# Altium schematic sheet pwr.SchDoc
size A4; Organization: Arribada Initiative; Address1: https://github.com/arribada; Address2: contact@arribada.org; Address3: arribada.org; Address4: UK - Portsmouth; DocumentNumber: 3; SheetNumber: 3; SheetTotal: 13
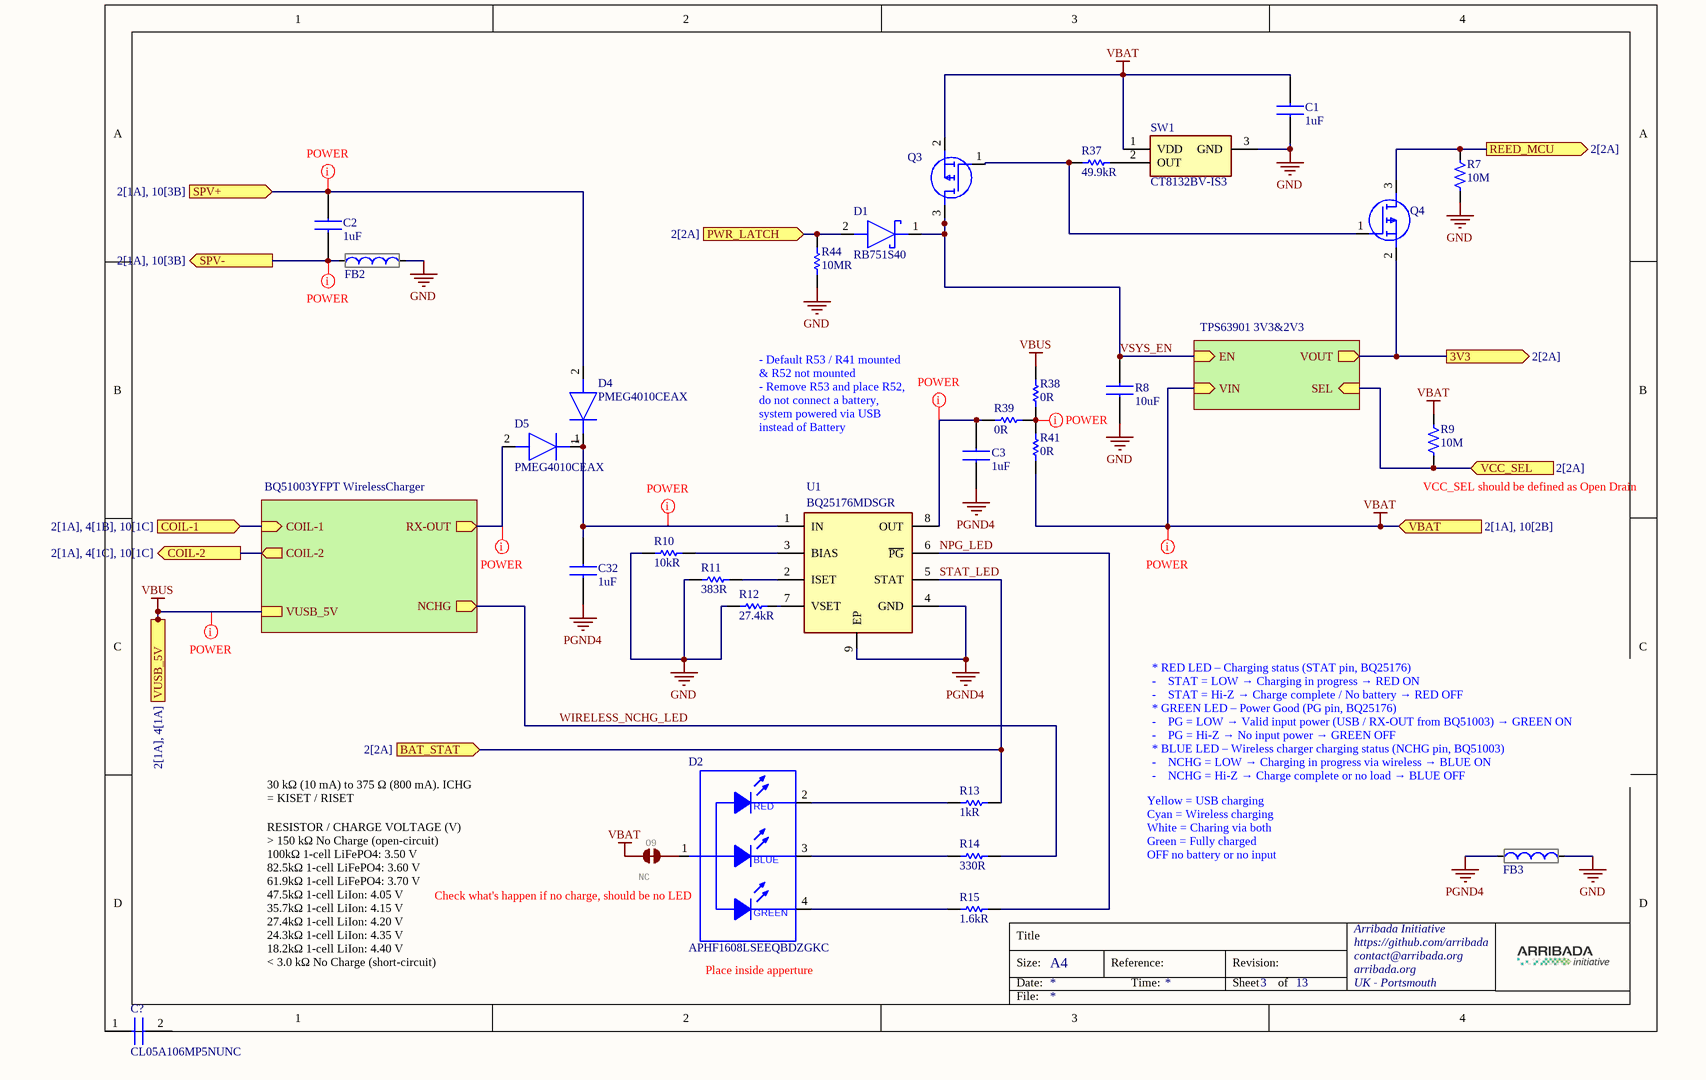
[diagram p0: pwr.SchDoc]

## Parts
C1  value 1uF  [CAPC1005X55N]  (hidden comment: GRM155R61E105KE11D)
C2  value 1uF  [GRM15x]  (hidden comment: GRM155R61H105ME05J)
C3  value 1uF  [CAPC1608X90N]  (hidden comment: GCM188R71C105KA64D)
C32  value 1uF  [GRM15x]  (hidden comment: GRM155R61H105ME05J)
C?  CL05A106MP5NUNC  [CAPC1005X55N]
D1  RB751S40  [SODFL1608X65N]
D2  APHF1608LSEEQBDZGKC  [LED RGB 0603]
D4  PMEG4010CEAX  [SOD2512X110N]
D5  PMEG4010CEAX  [SOD2512X110N]
FB2  BLM18AG102SN1D  [BLM18SP221SN1B]  (value not drawn)
FB3  BLM18AG102SN1D  [BLM18SP221SN1B]  (value not drawn)
O9  NC  [SMT-JUMPER_2_NC_TRACE_SILK]  (net tie, no BOM)
Q3  IRLML6401TRPBF  [SOT95P237X112-3N]  (value not drawn)
Q4  IRLML6401TRPBF  [SOT95P237X112-3N]  (value not drawn)
R7  value 10M  [RES0402L]  (hidden comment: 10M 0402 1%)
R8  value 10uF  [CAPC1005X55N]  (hidden comment: CL05A106MP5NUNC)
R9  value 10M  [RES0402L]  (hidden comment: 10M 0402 1%)
R10  value 10kR  [ERJS02_U02_(0402)]  (hidden comment: ERJ-U02F1002X)
R11  value 383R  [RESC0603X28N]  (hidden comment: CRCW0201383RFNED)
R12  value 27.4kR  [RESC0603X28N]  (hidden comment: CRCW020127K4FNED)
R13  value 1kR  [RESC1005X40N]  (hidden comment: RC0402JR-7D1KL)
R14  value 330R  [RESC1005X40N]  (hidden comment: RC0402JR-7D330RL)
R15  value 1.6kR  [RESC1005X40N]  (hidden comment: CRCW04021K60JNED)
R37  value 49.9kR  [RESC1005X40N]  (hidden comment: CRCW040249K9FKED)
R38  value 0R  [RESC1005X40N]  (hidden comment: CRCW04020000Z0EEHP)
R39  value 0R  [RESC1005X40N]  (hidden comment: CRCW04020000Z0EEHP)
R41  value 0R  [RESC1005X40N]  (hidden comment: CRCW04020000Z0EEHP)
R44  value 10MR  [RESC0603X26N]  (hidden comment: RC0201FR-0710ML)
SW1  CT8132BV-IS3  [SOT95P280X140-3N]
U1  BQ25176MDSGR  [SON50P200X200X80-9N]

## Sub-sheets
BQ51003YFPT WirelessCharger = BQ51003YFPT_WirelessCharger_2.5W: COIL-2 (out), COIL-1 (in), RX-OUT (out), VUSB_5V, NCHG (out)
TPS63901 3V3&2V3 = TPS63901_BuckBoost_lowIq_3V3&2V3_400mA: VIN (in), VOUT (out), EN (in), SEL (in)

## Ports
3V3 (out, see 2[2A]), BAT_STAT (in, see 2[2A]), COIL-1 (in, see 2[1A], 4[1B], 10[1C]), COIL-2 (out, see 2[1A], 4[1C], 10[1C]), PWR_LATCH (in, see 2[2A]), REED_MCU (out, see 2[2A]), SPV+ (in, see 2[1A], 10[3B]), SPV- (out, see 2[1A], 10[3B]), VBAT (in, see 2[1A], 10[2B]), VCC_SEL (in, see 2[2A]), VUSB_5V (see 2[1A], 4[1A])

## Nets
GND: C1.2 FB2.2 FB3.2 R7.1 R8.1 R10.1 R11.1 R12.1 R44.1 SW1.3(GND)
PGND4: C3.1 C32.2 FB3.1 U1.4(GND) U1.9(EP)
VBAT: C1.1 O9.1 Q3.2(S) R9.2 R41.2 SW1.1(VDD) ; port VBAT, sheet TPS63901 3V3&2V3/VIN
VBUS: R38.2 ; port VUSB_5V, sheet BQ51003YFPT WirelessCharger/VUSB_5V
3V3: Q4.2(S) ; port 3V3, sheet TPS63901 3V3&2V3/VOUT
COIL-1: port COIL-1, sheet BQ51003YFPT WirelessCharger/COIL-1
COIL-2: port COIL-2, sheet BQ51003YFPT WirelessCharger/COIL-2
NPG_LED: R15.2 U1.6(~{PG})
PWR_LATCH: D1.2(A) R44.2 ; port PWR_LATCH
REED_MCU: Q4.3(D) R7.2 ; port REED_MCU
SPV+: C2.1 D4.2(A) ; port SPV+
SPV-: C2.2 FB2.1 ; port SPV-
STAT_LED: R13.2 U1.5(STAT) ; port BAT_STAT
VCC_SEL: R9.1 ; port VCC_SEL, sheet TPS63901 3V3&2V3/SEL
VSYS_EN: D1.1(K) Q3.3(D) R8.2 ; sheet TPS63901 3V3&2V3/EN
WIRELESS_NCHG_LED: R14.1 ; sheet BQ51003YFPT WirelessCharger/NCHG
NetC3_2: C3.2 R39.1 U1.8(OUT)
NetC32_1: C32.1 D4.1(K) D5.1(K) U1.1(IN)
NetD2_1: D2.1 O9.2
NetD2_2: D2.2 R13.1
NetD2_3: D2.3 R14.2
NetD2_4: D2.4 R15.1
NetD5_2: D5.2(A) ; sheet BQ51003YFPT WirelessCharger/RX-OUT
NetQ3_1: Q3.1(G) Q4.1(G) R37.1
NetR10_2: R10.2 U1.3(BIAS)
NetR11_2: R11.2 U1.2(ISET)
NetR12_2: R12.2 U1.7(VSET)
NetR37_2: R37.2 SW1.2(OUT)
NetR38_1: R38.1 R39.2 R41.1

Not connected (* = marked no-connect by the designer): C? 1 2

## Layout directives
net class POWER; rule Width Constraint [Pref Width = 0.5mm    Min Width = 0.4mm    Max Width = 1mm]: NetC3_2, NetC32_1, NetD5_2, NetR38_1, SPV+, SPV-, VBAT, VBUS

## Notes on the sheet
- - Default R53 / R41 mounted & R52 not mounted
  - Remove R53 and place R52, do not connect a battery, system powered via USB instead of Battery
- (near R9) VCC_SEL should be defined as Open Drain
- * RED LED – Charging status (STAT pin, BQ25176)
  -    STAT = LOW → Charging in progress → RED ON
  -    STAT = Hi-Z → Charge complete / No battery → RED OFF
  * GREEN LED – Power Good (PG pin, BQ25176)
  -    PG = LOW → Valid input power (USB / RX-OUT from BQ51003) → GREEN ON
  -    PG = Hi-Z → No input power → GREEN OFF
  * BLUE LED – Wireless charger charging status (NCHG pin, BQ51003)
  -    NCHG = LOW → Charging in progress via wireless → BLUE ON
  -    NCHG = Hi-Z → Charge complete or no load → BLUE OFF
- 30 kΩ (10 mA) to 375 Ω (800 mA). ICHG = KISET / RISET
- (near D2) Check what's happen if no charge, should be no LED
- Yellow = USB charging
  Cyan = Wireless charging
  White = Charing via both
  Green = Fully charged
  OFF no battery or no input
- RESISTOR / CHARGE VOLTAGE (V)
  > 150 kΩ No Charge (open-circuit)
  100kΩ 1-cell LiFePO4: 3.50 V
  82.5kΩ 1-cell LiFePO4: 3.60 V
  61.9kΩ 1-cell LiFePO4: 3.70 V
  47.5kΩ 1-cell LiIon: 4.05 V
  35.7kΩ 1-cell LiIon: 4.15 V
  27.4kΩ 1-cell LiIon: 4.20 V
  24.3kΩ 1-cell LiIon: 4.35 V
  18.2kΩ 1-cell LiIon: 4.40 V
  < 3.0 kΩ No Charge (short-circuit)
- Place inside apperture
- Title
- Size:
- Date:
- A4
- Reference:
- Time:
- Revision:
- Sheet
- of
- File:
- (in symbol LED RGB 0603 2MA) RED; BLUE; GREEN

## Library data of the parts
C1 = GRM155R61E105KE11D: Multilayer Ceramic Capacitors MLCC - SMD/SMT 1 uF 25 VDC 10% 0402 X5R; Manufacturer_Name: Murata Electronics; Datasheet Link: http://www.murata.com/~/media/webrenewal/support/library/catalog/products/capacitor/mlcc/c02e.pdf; Height: 0.55mm; Manufacturer_Part_Number: GRM155R61E105KE11D; Mouser Part Number: 81-GRM155R61E105KE1D; Mouser Price/Stock: https://www.mouser.co.uk/ProductDetail/Murata-Electronics/GRM155R61E105KE11D?qs=QzBtWTOodeUQ00WJlpqFiw%3D%3D; Arrow Part Number: GRM155R61E105KE11D; Arrow Price/Stock: https://www.arrow.com/en/products/grm155r61e105ke11d/murata-manufacturing?region=nac
C2 C32 = GRM155R61H105ME05J: Multilayer Ceramic Capacitors MLCC - SMD/SMT 1 uF 50 VDC 20% 0402 X5R; Manufacturer: Murata; Material: 4241ConductorMaterial; Voltage Rating: 50V; Dielectric: 1537DielectricType; Supplier: Mouser; Supplier Part Number: 81-GRM155R61H105ME5J; Manufacturer Part Number: GRM155R61H105ME05J; RoHS: Yes; Category: Ceramic Capacitors; Stock: 30797; Pricing: 1=0,1, 10=0,045, 50=0,045, 100=0,027, 1000=0,02, 10000=0,014 (USD); Case/Package: 343Case; Min Operating Temperature: -55°C; Max Operating Temperature: 85°C; Tolerance: 20%; Voltage Rating (DC): 50V; Length: 1mm; Width: 500um; Height: 600um; Thickness: 500um; RoHS Compliant: 5897YesNo
C3 = GCM188R71C105KA64D: Multilayer Ceramic Capacitors MLCC - SMD/SMT 1 uF 16 VDC 10% 0603 X7R AEC-Q200; Manufacturer_Name: Murata Electronics; Datasheet Link: https://search.murata.co.jp/Ceramy/image/img/A01X/G101/ENG/GCM188R71C105KA64-04A.pdf; Height: 0.9mm; Manufacturer_Part_Number: GCM188R71C105KA64D; Mouser Part Number: 81-GCM188R71C105K64D; Mouser Price/Stock: https://www.mouser.co.uk/ProductDetail/Murata-Electronics/GCM188R71C105KA64D?qs=bQrJpfqjX%252BKtVgLYIBGvIg%3D%3D; Arrow Part Number: GCM188R71C105KA64D; Arrow Price/Stock: https://www.arrow.com/en/products/gcm188r71c105ka64d/murata-manufacturing?region=nac
C? = CL05A106MP5NUNC: Capacitor; Manufacturer_Name: SAMSUNG; Datasheet Link: http://media.digikey.com/pdf/Data%20Sheets/Samsung%20PDFs/CL_Series_MLCC_ds.pdf; Height: 0.55mm; Manufacturer_Part_Number: CL05A106MP5NUNC; Mouser Part Number: 187-CL05A106MP5NUNC; Mouser Price/Stock: https://www.mouser.co.uk/ProductDetail/Samsung-Electro-Mechanics/CL05A106MP5NUNC?qs=X6jEic%2FHinA5hRYAnV6SHQ%3D%3D; Arrow Part Number: CL05A106MP5NUNC; Arrow Price/Stock: https://www.arrow.com/en/products/cl05a106mp5nunc/samsung-electro-mechanics?utm_currency=USD&region=europe
D1 = RB751S40: Schottky Diodes & Rectifiers 40V,Schottky,SOD-523,0.3A; Manufacturer_Name: Nexperia; Datasheet Link: https://4donline.ihs.com/images/VipMasterIC/IC/NEXP/NEXP-S-A0012401467/NEXP-S-A0012401473-1.pdf?hkey=EF798316E3902B6ED9A73243A3159BB0; Height: 0.65mm; Manufacturer_Part_Number: RB751S40; Mouser Part Number: N/A; Mouser Price/Stock: https://www.mouser.co.uk/ProductDetail/Nexperia/RB751S40?qs=vHuUswq2%252BsxYe2VJDNOssA%3D%3D
D2 = LED RGB 0603 2MA: Manufacturer: Kingbright; Manufacturers Part Number: APHF1608LSEEQBDZGKC; Supplier 1: Mouser; Supplier 2: Digi-Key; Supplier Part Number 1: 604-APHF1608LQBDZGKC; Supplier Part Number 2: 754-2143-1-ND; Distributor 1: EBV; Distributor 2: Future Electronics; Colour: RGB; Value: APHF1608LSEEQBDZGKC
D4 D5 = PMEG4010CEAX: Diode; Manufacturer_Name: Nexperia; Datasheet Link: https://mouser.componentsearchengine.com/Datasheets/1/PMEG4010CEAX.pdf; Height: 1.1mm; Manufacturer_Part_Number: PMEG4010CEAX; Mouser Part Number: 771-PMEG4010CEAX; Mouser Price/Stock: https://www.mouser.co.uk/ProductDetail/Nexperia/PMEG4010CEAX?qs=0C8XhJW8e4oZXiLPP2pzOA%3D%3D; Arrow Part Number: PMEG4010CEAX; Arrow Price/Stock: https://www.arrow.com/en/products/pmeg4010ceax/nexperia
FB2 FB3 = BLM18AG102SN1D: Ferrite Bead - 1000 OHM 25%; Manufacturer_Name: Murata Electronics; Datasheet Link: http://www.murata.com/~/media/webrenewal/support/library/catalog/products/emc/emifil/c31e.ashx?la=en-gb; Height: 0.95mm; Manufacturer_Part_Number: BLM18AG102SN1D; Mouser Part Number: 81-BLM11A102S; Mouser Price/Stock: https://www.mouser.co.uk/ProductDetail/Murata-Electronics/BLM18AG102SN1D?qs=b2kFoOhrN4V4XjRBmusv4w%3D%3D; Arrow Part Number: BLM18AG102SN1D; Arrow Price/Stock: https://www.arrow.com/en/products/blm18ag102sn1d/murata-manufacturing?utm_currency=USD&region=nac
O9 = JUMPER-SMT_2_NC_TRACE_SILK: Normally closed trace jumper    This jumper has a trace between two pads so it's normally closed (NC). Use a razor knife to open the connection. For best results follow the IPC guidelines for cutting traces: Cutout at least 0.063 mm (0.005 in).  Remove all loose material to clean up the cut area.  Seal the cut with an approved epoxy.       Reapply solder to reclose the connection.; GateName_1: G$1; SymbolName_1: SMT-JUMPER_2_NC_TRACE; DeviceName: _SILK; LibraryName: SparkFun-Jumpers; DeviceSetName: JUMPER-SMT_2_NC_TRACE
Q3 Q4 = IRLML6401TRPBF: MOSFETs MOSFT P-Ch -4.3A 50mOhm 10nC Log Lvl; Manufacturer_Name: Infineon; Datasheet Link: https://www.infineon.com/dgdl/irlml6401pbf.pdf?fileId=5546d462533600a401535668b96d2634; Height: 1.12mm; Manufacturer_Part_Number: IRLML6401TRPBF; Mouser Part Number: 942-IRLML6401TRPBF; Mouser Price/Stock: https://www.mouser.co.uk/ProductDetail/Infineon-Technologies/IRLML6401TRPBF?qs=9%252BKlkBgLFf1wviSVMCNr8A%3D%3D; Arrow Part Number: IRLML6401TRPBF; Arrow Price/Stock: https://www.arrow.com/en/products/irlml6401trpbf/infineon-technologies-ag?utm_currency=USD&region=europe
R7 R9 = RES 10M 0402 1% 100PPM: PPM: 100; Manufacturer: *; Manufacturers Part Number: *; Tolerance: 1%; Size: 0402; Supplier 1: Mouser; Supplier 2: Digi-Key; Supplier Part Number 1: 603-RC0402FR-0710ML; Supplier Part Number 2: 311-10.0MLRCT-ND
R8 = CL05A106MP5NUNC: Multilayer Ceramic Capacitors MLCC - SMD/SMT 10uF+/-20% 10V X5R 1005; Manufacturer_Name: SAMSUNG; Description: 0402 CAP CER 10UF 10V X5R; Datasheet Link: http://media.digikey.com/pdf/Data%20Sheets/Samsung%20PDFs/CL_Series_MLCC_ds.pdf; Height: 0.55mm; Manufacturer_Part_Number: CL05A106MP5NUNC; Mouser Part Number: 187-CL05A106MP5NUNC; Mouser Price/Stock: https://www.mouser.co.uk/ProductDetail/Samsung-Electro-Mechanics/CL05A106MP5NUNC?qs=X6jEic%2FHinA5hRYAnV6SHQ%3D%3D; Arrow Part Number: CL05A106MP5NUNC; Arrow Price/Stock: https://www.arrow.com/en/products/cl05a106mp5nunc/samsung-electro-mechanics?utm_currency=USD&region=europe
R10 = ERJ-U02F1002X: Thick Film Resistors - SMD 0402 1% 10Kohm Anti-Sulfur AEC-Q200; Manufacturer_Name: Panasonic; Datasheet Link: https://industrial.panasonic.com/cdbs/www-data/pdf/RDP0000/AOA0000C334.pdf; Height: 0.4mm; Manufacturer_Part_Number: ERJ-U02F1002X; Mouser Part Number: 667-ERJ-U02F1002X; Mouser Price/Stock: https://www.mouser.co.uk/ProductDetail/Panasonic/ERJ-U02F1002X?qs=bKFmlxG1yYBnPvi8EiFM4A%3D%3D; Arrow Part Number: ERJ-U02F1002X; Arrow Price/Stock: https://www.arrow.com/en/products/erj-u02f1002x/panasonic
R11 = CRCW0201383RFNED: Thick Film Resistors - SMD 383ohm 1% 200ppm; Manufacturer: Vishay; Supplier: Digikey; Supplier Part Number: 541-CRCW0201383RFNEDCT-ND; Manufacturer Part Number: CRCW0201383RFNED; RoHS: Yes; Category: Chip SMD Resistors; Stock: 17699; Pricing: 1=0,1, 10=0,041, 100=0,0209, 1000=0,01231, 2500=0,01038, 5000=0,00928 (USD); ComponentLink1URL: https://datasheet.ciiva.com/5860/1697337-5860072.pdf?src-supplier=Farnell; ComponentLink1Description: https://datasheet.ciiva.com/5860/1697337-5860072.pdf?src-supplier=Farnell; ComponentLink2URL: https://datasheet.ciiva.com/22683/1700795-22683160.pdf?src-supplier=Element14; ComponentLink2Description: https://datasheet.ciiva.com/22683/1700795-22683160.pdf?src-supplier=Element14
R12 = CRCW020127K4FNED: Resistor; Manufacturer_Name: Vishay; Datasheet Link: http://www.vishay.com/docs/20035/dcrcwe3.pdf; Height: 0.28mm; Manufacturer_Part_Number: CRCW020127K4FNED; Arrow Part Number: CRCW020127K4FNED; Arrow Price/Stock: https://www.arrow.com/en/products/crcw020127k4fned/vishay
R13 = RC0402JR-7D1KL: Thick Film Resistors - SMD 1 kOhms 62.5 mW 0402 5%; Manufacturer: Yageo; Supplier: Mouser; Supplier Part Number: 603-RC0402JR-7D1KL; Manufacturer Part Number: RC0402JR-7D1KL; RoHS: Yes; Category: Resistors; Stock: 654509; Pricing: 1=0,1, 10=0,008, 50=0,008, 100=0,006, 1000=0,004, 10000=0,001 (USD); Case/Package: 0402; Tolerance: 5%; RoHS Compliant: Yes
R14 = RC0402JR-7D330RL: Thick Film Resistors - SMD 330 Ohms 62.5mW 0402 5%; Manufacturer_Name: KEMET; Datasheet Link: http://www.yageo.com/documents/recent/PYu-RC0402_51_RoHS_L_6_r.pdf; Height: 0.4mm; Manufacturer_Part_Number: RC0402JR-7D330RL; Mouser Part Number: 603-RC0402JR-7D330RL; Mouser Price/Stock: https://www.mouser.co.uk/ProductDetail/YAGEO/RC0402JR-7D330RL?qs=F5EMLAvA7IAWTmBu9ZK%2FAQ%3D%3D; Arrow Part Number: RC0402JR-7D330RL; Arrow Price/Stock: https://www.arrow.com/en/products/rc0402jr-7d330rl/yageo
R15 = CRCW04021K60JNED: Thick Film Resistors - SMD 1/16watt 1.6Kohms 5%; Manufacturer_Name: Vishay; Datasheet Link: http://www.vishay.com/docs/20035/dcrcwe3.pdf; Height: 0.4mm; Manufacturer_Part_Number: CRCW04021K60JNED; Mouser Part Number: 71-CRCW0402J-1.6K-E3; Mouser Price/Stock: https://www.mouser.co.uk/ProductDetail/Vishay-Dale/CRCW04021K60JNED?qs=YX%252BK5oaHNYoma9PjuMNZCA%3D%3D
R37 = CRCW040249K9FKED: Thick Film Resistors - SMD 1/16watt 49.9Kohms 1%; Manufacturer_Name: Vishay; Datasheet Link: http://www.vishay.com/docs/20035/dcrcwe3.pdf; Height: 0.4mm; Manufacturer_Part_Number: CRCW040249K9FKED; Mouser Part Number: 71-CRCW0402-49.9K-E3; Mouser Price/Stock: https://www.mouser.co.uk/ProductDetail/Vishay-Dale/CRCW040249K9FKED?qs=hAuyw6LW%252BLhwjtjsHx%2FGDQ%3D%3D; Arrow Part Number: CRCW040249K9FKED; Arrow Price/Stock: https://www.arrow.com/en/products/crcw040249k9fked/vishay?region=nac
R38 R39 R41 = CRCW04020000Z0EEHP: Thick Film Resistors - SMD CRCW 402 jumper; Manufacturer_Name: Vishay; Datasheet Link: http://www.vishay.com/docs/20035/dcrcwe3.pdf; Height: 0.4mm; Manufacturer_Part_Number: CRCW04020000Z0EEHP; Mouser Part Number: 71-CRCW04020000Z0EEH; Mouser Price/Stock: https://www.mouser.co.uk/ProductDetail/Vishay-Dale/CRCW04020000Z0EEHP?qs=Imq1NPwxi74NTc567q7flQ%3D%3D; Arrow Part Number: CRCW04020000Z0EEHP; Arrow Price/Stock: https://www.arrow.com/en/products/crcw04020000z0eehp/vishay?utm_currency=USD&region=nac
R44 = RC0201FR-0710ML: Thick Film Resistors - SMD 10 MOhms 50mW 0201 1%; Manufacturer_Name: KEMET; Datasheet Link: http://www.yageo.com/documents/recent/PYu-RC0201_51_RoHS_L_8.pdf; Height: 0.26mm; Manufacturer_Part_Number: RC0201FR-0710ML; Mouser Part Number: 603-RC0201FR-0710ML; Mouser Price/Stock: https://www.mouser.com/Search/Refine.aspx?Keyword=603-RC0201FR-0710ML; Arrow Part Number: RC0201FR-0710ML; Arrow Price/Stock: https://www.arrow.com/en/products/rc0201fr-0710ml/yageo
SW1 = CT8132BV-IS3: Board Mount Hall Effect/Magnetic Sensors Integrated Digital Omnipolar, TMR, High Sensitivity Magnetic Switch, SOT23 Package, Ind Temp, 2Hz; Manufacturer_Name: Allegro MicroSystems; Datasheet Link: https://www.mouser.fr/datasheet/2/1115/Allegro_DS_CT813x_Datasheet_GS_FINAL_R2_v2-3441103.pdf; Height: 1.4mm; Manufacturer_Part_Number: CT8132BV-IS3; Mouser Part Number: 462-CT8132BV-IS3; Mouser Price/Stock: https://www.mouser.fr/ProductDetail/Allegro-MicroSystems/CT8132BV-IS3?qs=GBLSl2Akirsc7cUAudCqXg%3D%3D
U1 = BQ25176MDSGR: Battery Management 800-mA linear batter y charger for one-ce; Manufacturer_Name: Texas Instruments; Datasheet Link: https://www.ti.com/lit/gpn/bq25176m; Height: 0.8mm; Manufacturer_Part_Number: BQ25176MDSGR; Mouser Part Number: 595-BQ25176MDSGR; Mouser Price/Stock: https://www.mouser.co.uk/ProductDetail/Texas-Instruments/BQ25176MDSGR?qs=Y0Uzf4wQF3nVhcdITj52nA%3D%3D; Arrow Part Number: BQ25176MDSGR; Arrow Price/Stock: https://www.arrow.com/en/products/bq25176mdsgr/texas-instruments?region=nac